# Altium schematic sheet L298N.SchDoc
size A4
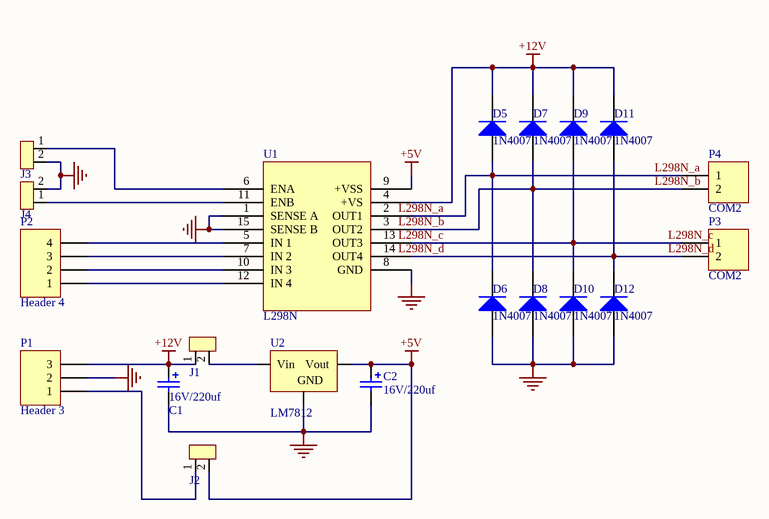
[diagram p0: L298N.SchDoc]

## Parts
C1  16V/220uf  [RB5/8]
C2  16V/220uf  [RB5/8]
D5  1N4007  [Diode0.3]
D6  1N4007  [Diode0.3]
D7  1N4007  [Diode0.3]
D8  1N4007  [Diode0.3]
D9  1N4007  [Diode0.3]
D10  1N4007  [Diode0.3]
D11  1N4007  [Diode0.3]
D12  1N4007  [Diode0.3]
J1  (no value)  [SIP2]
J2  CN2  [SIP2]  (value not drawn)
J3  (no value)  [XH2.54-2P]
J4  (no value)  [XH2.54-2P]
P1  Header 3  [XH5.08-3P]
P2  Header 4  [XH2.54-4P]
P3  COM2  [XH5.08-2P]
P4  COM2  [XH5.08-2P]
U1  L298N  [L298N散热片]
U2  LM7812  [TO-220]

## Nets
+5V: C2.1 J2.2 U1.9(+VSS) U2.3(Vout)
+12V: C1.1 D5.2(K) D7.2(K) D9.2(K) D11.2(K) J1.1 P1.3 U1.4(+VS)
GND: C1.2 C2.2 D6.1(A) D8.1(A) D10.1(A) D12.1(A) J3.2 J4.2 P1.2 U1.1(SENSE_A) U1.8(GND) U1.15(SENSE_B) U2.2(GND)
L298N_a: D5.1(A) D6.2(K) P4.1 U1.2(OUT1)
L298N_b: D7.1(A) D8.2(K) P4.2 U1.3(OUT2)
L298N_c: D9.1(A) D10.2(K) P3.1 U1.13(OUT3)
L298N_d: D11.1(A) D12.2(K) P3.2 U1.14(OUT4)
NetJ1_2: J1.2 U2.1(Vin)
NetJ2_1: J2.1 P1.1
NetJ3_1: J3.1 U1.6(ENA)
NetJ4_1: J4.1 U1.11(ENB)
NetP2_1: P2.1 U1.12(IN_4)
NetP2_2: P2.2 U1.10(IN_3)
NetP2_3: P2.3 U1.7(IN_2)
NetP2_4: P2.4 U1.5(IN_1)

## Notes on the sheet
- Labels drawn without touching a wire or pin: L298N_a, L298N_b, L298N_c, L298N_d

## Library data of the parts
C1 C2 = RB: Polarized Capacitor (Radial); Published: 8-Jun-2000; LatestRevisionDate: 17-Jul-2002; LatestRevisionNote: Re-released for DXP Platform.; Publisher: Altium Limited
D5-D12 = Diode 1N4007: 1 Amp General Purpose Rectifier; Published: 8-Jun-2000; LatestRevisionDate: 17-Jul-2002; LatestRevisionNote: Re-released for DXP Platform.; DatasheetDocument: 1998; PackageDocument: Aug-1999; PackageReference: DO-41; Publisher: Altium Limited; Code_JEDEC: DO-204-AL; ComponentLink1Description: Manufacturer Link; ComponentLink1URL: http://www.fairchildsemi.com/; ComponentLink2Description: Datasheet; ComponentLink2URL: http://www.fairchildsemi.com/ds/1N%2F1N4001.pdf
J1 J3 J4 = CN2
P1 = Header 3: Header, 3-Pin; LatestRevisionDate: 17-Jul-2002; LatestRevisionNote: Re-released for DXP Platform.; Publisher: Altium Limited
P2 = Header 4: Header, 4-Pin; LatestRevisionDate: 17-Jul-2002; LatestRevisionNote: Re-released for DXP Platform.; Publisher: Altium Limited
P3 P4 = Header 2: Header, 2-Pin; LatestRevisionDate: 17-Jul-2002; LatestRevisionNote: Re-released for DXP Platform.; Publisher: Altium Limited
U2 = Voltage regulator: Published: 24-Mar-1999; LatestRevisionDate: 17-Jul-2002; LatestRevisionNote: Re-released for DXP Platform.; Publisher: Altium Limited; Code_JEDEC: SMD-220